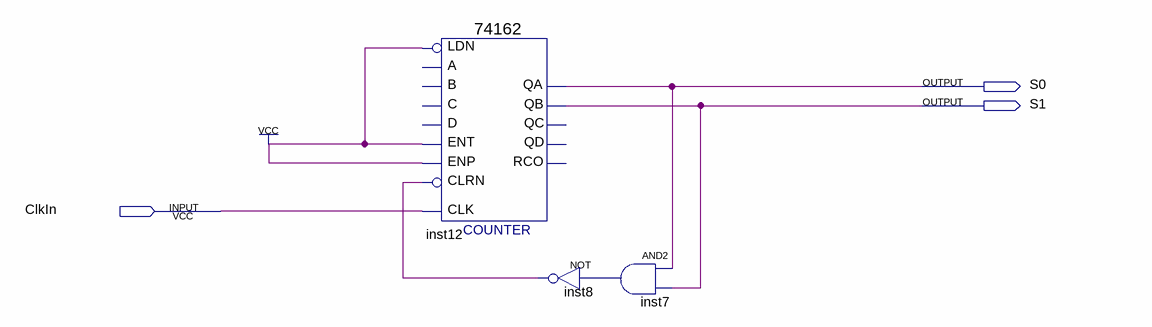
[diagram p0: schematic sheet]
// Quartus schematic contador0a3.bdf as structural Verilog: 3 symbols, 3 pins
module contador0a3 (
  input  ClkIn,
  output S0,
  output S1
);

  wire inst7_out, inst8_out;

  \74162  inst12 (
    .LDN(1'b1), .ENP(1'b1), .ENT(1'b1), .CLRN(inst8_out), .CLK(ClkIn), .QA(S0), .QB(S1));  // open: A, B, C, D, QC, QD, RCO
  not inst8 (inst8_out, inst7_out);
  and inst7 (inst7_out, S0, S1);
endmodule
